# Altium schematic sheet TECController.SchDoc
size 381 x 241 mm; SheetNumber: 6; SheetTotal: 6
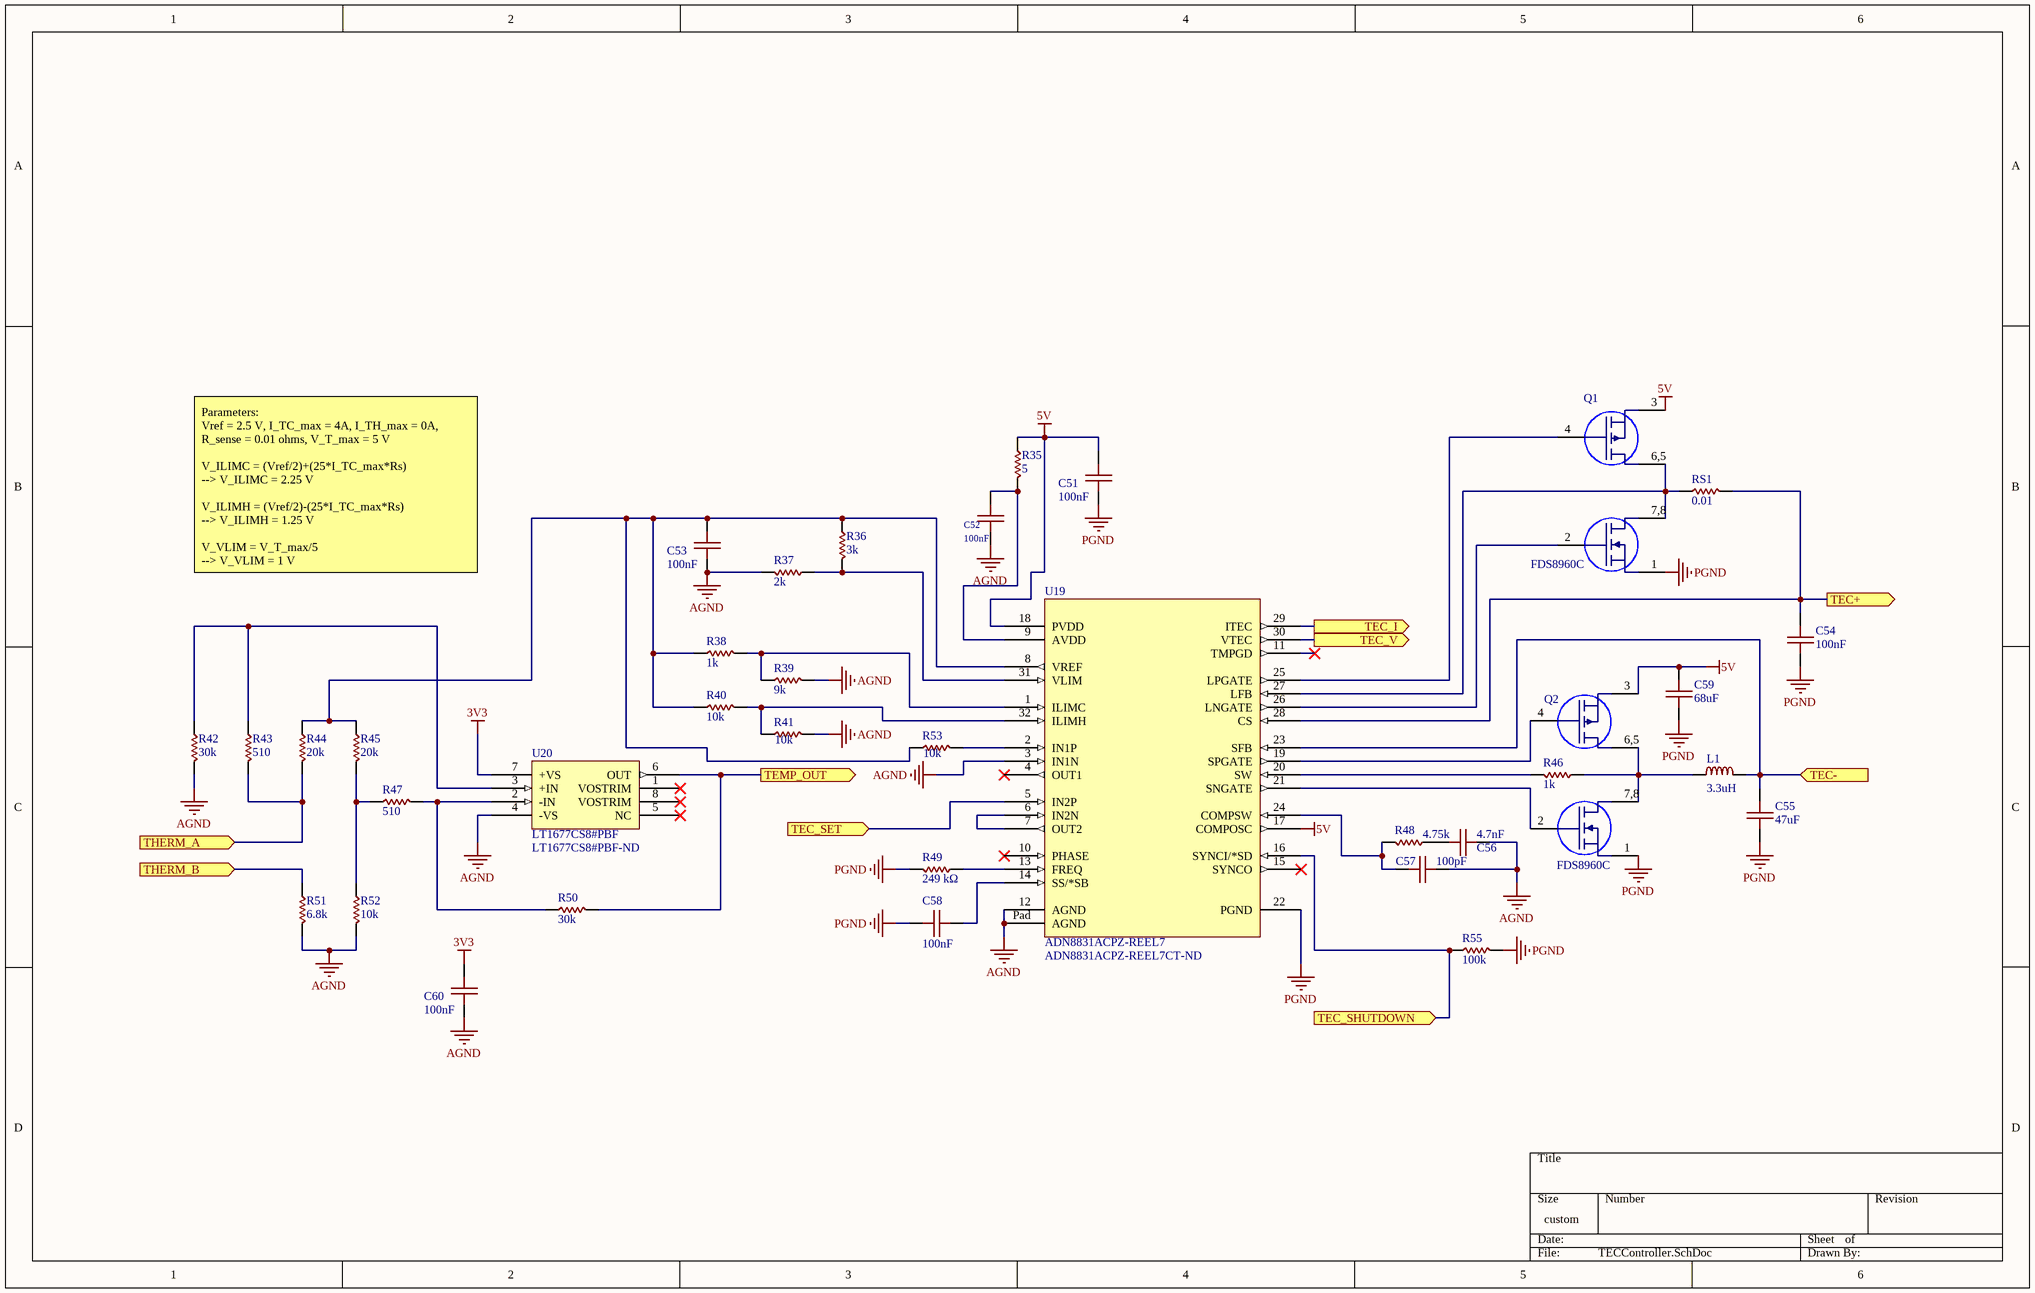
[diagram p0: TECController.SchDoc]

## Parts
C51  100nF  [0603 B]
C52  100nF  [0603 B]
C53  100nF  [0603 B]
C54  100nF  [0603 B]
C55  47uF  [0805 B]
C56  4.7nF  [0603 B]
C57  100pF  [0603 B]
C58  100nF  [0603 B]
C59  68uF  [1206 B]
C60  100nF  [0603 B]
L1  3.3uH  [SRP0520]
Q1  FDS8960C  [SO-8]
Q2  FDS8960C  [SO-8]
R35  5  [0805]
R36  3k  [0603]
R37  2k  [0603]
R38  1k  [0603]
R39  9k  [0603]
R40  10k  [0603]
R41  10k  [0603]
R42  30k  [0603]
R43  510  [0603]
R44  20k  [0603]
R45  20k  [0603]
R46  1k  [0603]
R47  510  [0603]
R48  4.75k  [0603]
R49  249 kΩ  [0603]
R50  30k  [0603]
R51  6.8k  [0603]
R52  10k  [0603]
R53  10k  [0603]
R55  100k  [0603]
RS1  0.01  [1206]
U19  ADN8831ACPZ-REEL7  Supplier Part Number 1: ADN8831ACPZ-REEL7CT-ND  [LFCSP CP 32 7]
U20  LT1677CS8#PBF  Supplier Part Number 1: LT1677CS8#PBF-ND  [SO-8_S_LIT]

## Ports
TEC+ (out), TEC- (in), TEC_I (out), TEC_SET (in), TEC_SHUTDOWN (in), TEC_V (out), TEMP_OUT (out), THERM_A (in), THERM_B (in)

## Nets
3V3: C60.1 U20.7(+VS)
5V: C51.1 C59.2 Q1.3 Q2.3 R35.2 U19.17(COMPOSC) U19.18(PVDD)
AGND: C52.2 C53.2 C56.2 C57.2 C60.2 R37.1 R39.1 R41.1 R42.1 R51.1 R52.1 U19.3(IN1N) U19.12(AGND) U19.Pad(AGND) U20.4(-VS)
PGND: C51.2 C54.1 C55.1 C58.1 C59.1 Q1.1 Q2.1 R49.1 R55.1 U19.22(PGND)
TEC+: C54.2 RS1.1 U19.28(CS) ; port TEC+
TEC-: C55.2 L1.1 U19.23(SFB) ; port TEC-
TEC_I: U19.29(ITEC) ; port TEC_I
TEC_SET: U19.5(IN2P) ; port TEC_SET
TEC_SHUTDOWN: R55.2 U19.16(SYNCI/*SD) ; port TEC_SHUTDOWN
TEC_V: U19.30(VTEC) ; port TEC_V
TEMP_OUT: R50.1 U20.6(OUT) ; port TEMP_OUT
THERM_A: R43.1 R44.1 ; port THERM_A
THERM_B: R51.2 ; port THERM_B
NetC52_1: C52.1 R35.1 U19.9(AVDD)
NetC53_1: C53.1 R36.2 R38.2 R40.2 R44.2 R45.2 R53.2 U19.8(VREF)
NetC56_1: C56.1 R48.2
NetC57_1: C57.1 R48.1 U19.24(COMPSW)
NetC58_2: C58.2 U19.14(SS/*SB)
NetL1_2: L1.2 Q2.6,5 Q2.7,8 R46.2
NetQ1_2: Q1.2 U19.26(LNGATE)
NetQ1_4: Q1.4 U19.25(LPGATE)
NetQ1_6,5: Q1.6,5 Q1.7,8 RS1.2 U19.27(LFB)
NetQ2_2: Q2.2 U19.21(SNGATE)
NetQ2_4: Q2.4 U19.19(SPGATE)
NetR36_1: R36.1 R37.2 U19.31(VLIM)
NetR38_1: R38.1 R39.2 U19.1(ILIMC)
NetR40_1: R40.1 R41.2 U19.32(ILIMH)
NetR42_2: R42.2 R43.2 U20.3(+IN)
NetR45_1: R45.1 R47.2 R52.2
NetR46_1: R46.1 U19.20(SW)
NetR47_1: R47.1 R50.2 U20.2(-IN)
NetR49_2: R49.2 U19.13(FREQ)
NetR53_1: R53.1 U19.2(IN1P)
NetU19_6: U19.6(IN2N) U19.7(OUT2)

Not connected (* = marked no-connect by the designer): U19 4(OUT1)* 10(PHASE)* 11(TMPGD)* 15(SYNCO)*; U20 1(VOSTRIM)* 5(NC)* 8(VOSTRIM)*

## Notes on the sheet
- Parameters:
  Vref = 2.5 V, I_TC_max = 4A, I_TH_max = 0A, R_sense = 0.01 ohms, V_T_max = 5 V
  V_ILIMC = (Vref/2)+(25*I_TC_max*Rs)
  --> V_ILIMC = 2.25 V
  V_ILIMH = (Vref/2)-(25*I_TC_max*Rs)
  --> V_ILIMH = 1.25 V
  V_VLIM = V_T_max/5
  --> V_VLIM = 1 V

## Library data of the parts
C51-C54 C56-C58 C60 = CAP 0603: 603 Capacitor
  C51-C54 C58 C60: Value: 100nF
  C56: Value: 4.7nF
  C57: Value: 100pF
C55 = CAP 0805: 805 Capacitor; Value: 47uF
C59 = CAP 1206: 1206 Capacitor; Value: 68uF
L1 = IND 3.3uH 4.8A SMD: Bourns SRP0520 3.3uH 4.8A Inductor; Ref: IHLP3232DZER330M11; Value: 3.3uH
Q1 Q2 = FDS8960C: MOSFET pair
R35 = RES 0805: 805 Resistor; Value: 5
R36 = RES 0603: 603 Resistor; Value: 6k
R37 = RES 0603: 603 Resistor; Value: 4k
R38-R48 R50-R53 R55 = RES 0603: 603 Resistor
  R38 R46: Value: 1k
  R39: Value: 9k
  R40 R41 R52 R53: Value: 10k
  R42 R50: Value: 30k
  R43 R47: Value: 510
  R44 R45: Value: 20k
  R48: Value: 4.75k
  R51: Value: 6.8k
  R55: Value: 100k
R49 = RES 0603: 603 Resistor; Value: 249k
RS1 = RES 1206: 1206 Resistor; Value: 0.01
U19 = ADN8831ACPZ-REEL7: A High Efficiency TEC Controller Solution; SourceLibrary: Analog_2015-01-06; Built_By: EMA_UL_Team; Vendor: Analog Devices Inc; Manufacturer_Part_Number: ADN8831ACPZ-REEL7; Copyright: Copyright (C) 2018 Accelerated Designs. All rights reserved; RefDes: RefDes; Type: DEV; Supplier 1: Digi-Key
U20 = LT1677CS8#PBF: Low Noise, Rail-to-Rail Precision Op Amp; Vendor: Linear Technology; Built_By: EMA_UL_Team; SourceLibrary: LinearTech_2016-05-13_8; Manufacturer_Part_Number: LT1677CS8#PBF; Copyright: Copyright (C) 2018 Accelerated Designs. All rights reserved; RefDes: RefDes; Type: DEV; Supplier 1: Digi-Key